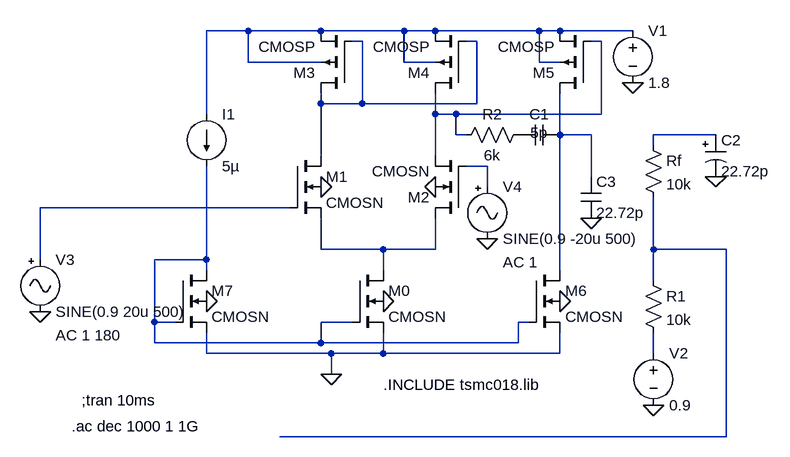
[diagram p0: schematic 2stage_OTA_230102044.asc]
2stage_OTA_230102044.asc, the LTspice schematic file:
Version 4
SHEET 1 988 680
WIRE -16 32 -80 32
WIRE 96 32 -16 32
WIRE 224 32 96 32
WIRE 272 32 224 32
WIRE 432 32 272 32
WIRE 464 32 432 32
WIRE 576 32 464 32
WIRE 160 48 144 48
WIRE 336 48 320 48
WIRE 528 48 512 48
WIRE -16 80 -16 32
WIRE 96 80 -16 80
WIRE 224 80 224 32
WIRE 272 80 224 80
WIRE 432 80 432 32
WIRE 464 80 432 80
WIRE 96 144 96 128
WIRE 160 144 160 48
WIRE 160 144 96 144
WIRE 336 144 336 48
WIRE 336 144 160 144
WIRE -80 160 -80 32
WIRE 272 160 272 128
WIRE 304 160 272 160
WIRE 528 160 528 48
WIRE 528 160 304 160
WIRE 304 192 304 160
WIRE 320 192 304 192
WIRE 464 192 464 128
WIRE 512 192 464 192
WIRE 704 192 608 192
WIRE 608 208 608 192
WIRE 96 224 96 144
WIRE 272 224 272 160
WIRE 352 240 320 240
WIRE 512 256 512 192
WIRE 352 272 352 240
WIRE 48 304 -336 304
WIRE 96 368 96 320
WIRE 192 368 96 368
WIRE 272 368 272 320
WIRE 272 368 192 368
WIRE 608 368 608 288
WIRE 720 368 608 368
WIRE -336 384 -336 304
WIRE -80 384 -80 240
WIRE -80 384 -160 384
WIRE -80 400 -80 384
WIRE 192 400 192 368
WIRE 464 400 464 192
WIRE 608 416 608 368
WIRE -160 480 -160 384
WIRE -128 480 -160 480
WIRE 144 480 96 480
WIRE 416 480 400 480
WIRE -160 512 -160 480
WIRE 96 512 96 480
WIRE 96 512 -160 512
WIRE 400 512 400 480
WIRE 400 512 96 512
WIRE -80 528 -80 496
WIRE 112 528 -80 528
WIRE 192 528 192 496
WIRE 192 528 112 528
WIRE 464 528 464 496
WIRE 464 528 192 528
WIRE 608 528 608 496
WIRE 112 560 112 528
WIRE 720 656 720 368
WIRE 720 656 32 656
FLAG 576 112 0
FLAG 272 272 0
FLAG 96 272 0
FLAG 192 448 0
FLAG -80 448 0
FLAG 608 608 0
FLAG 352 352 0
FLAG 112 560 0
FLAG 704 256 0
FLAG 512 320 0
FLAG -336 464 0
FLAG 464 448 0
SYMBOL current -80 160 R0
WINDOW 123 0 0 Left 2
WINDOW 39 0 0 Left 2
SYMATTR InstName I1
SYMATTR Value 5µ
SYMBOL cmosp 144 128 R180
SYMATTR InstName M3
SYMATTR Value2 l=0.9um w=17.55um
SYMBOL cmosp 320 128 R180
SYMATTR InstName M4
SYMATTR Value2 l=0.9um w=17.55um
SYMBOL cmosn -128 400 R0
SYMATTR InstName M7
SYMATTR Value2 l=0.9um w=0.98um
SYMBOL cmosn 144 400 R0
SYMATTR InstName M0
SYMATTR Value2 l=0.9um w=9.78um
SYMBOL cmosn 48 224 R0
SYMATTR InstName M1
SYMATTR Value2 l=0.9um w=0.22mm
SYMBOL cmosn 320 320 R180
SYMATTR InstName M2
SYMATTR Value2 l=0.9um w=0.22mm
SYMBOL res 592 192 R0
SYMATTR InstName Rf
SYMATTR Value 10k
SYMBOL res 592 400 R0
SYMATTR InstName R1
SYMATTR Value 10k
SYMBOL voltage 608 512 R0
WINDOW 123 0 0 Left 2
WINDOW 39 0 0 Left 2
SYMATTR InstName V2
SYMATTR Value 0.9
SYMBOL Misc\\signal 352 256 R0
WINDOW 123 24 132 Left 2
WINDOW 39 0 0 Left 2
SYMATTR Value2 AC 1
SYMATTR InstName V4
SYMATTR Value SINE(0.9 -20u 500)
SYMBOL cmosp 512 128 R180
SYMATTR InstName M5
SYMATTR Value2 l=0.18um w=14.06um
SYMBOL polcap 688 192 R0
WINDOW 3 24 56 Left 2
SYMATTR Value 22.72p
SYMATTR InstName C2
SYMATTR Description Capacitor
SYMATTR Type cap
SYMATTR SpiceLine V=6.3 Irms=0 Rser=4 Lser=0
SYMBOL cap 464 176 R90
WINDOW 0 0 32 VBottom 2
WINDOW 3 28 32 VBottom 2
SYMATTR InstName C1
SYMATTR Value 5p
SYMBOL res 416 176 R90
WINDOW 0 0 56 VBottom 2
WINDOW 3 32 56 VTop 2
SYMATTR InstName R2
SYMATTR Value 6k
SYMBOL cap 496 256 R0
SYMATTR InstName C3
SYMATTR Value 22.72p
SYMBOL voltage 576 16 R0
WINDOW 123 0 0 Left 2
WINDOW 39 0 0 Left 2
SYMATTR InstName V1
SYMATTR Value 1.8
SYMBOL Misc\\signal -336 368 R0
WINDOW 123 24 132 Left 2
WINDOW 39 0 0 Left 2
SYMATTR InstName V3
SYMATTR Value SINE(0.9 20u 500)
SYMATTR Value2 AC 1 180
SYMBOL cmosn 416 400 R0
SYMATTR InstName M6
SYMATTR Value2 l=0.18um w=3.19um
TEXT 192 576 Left 2 !.INCLUDE tsmc018.lib
TEXT -272 600 Left 2 !;tran 10ms
TEXT -288 640 Left 2 !.ac dec 1000 1 1G

The netlist it stands for:
* 2stage_OTA_230102044.asc
I1 N001 N010 5µ
M3 N002 N002 N001 N001 CMOSP l=0.9um w=17.55um
M4 N003 N002 N001 N001 CMOSP l=0.9um w=17.55um
M7 N010 N010 0 0 CMOSN l=0.9um w=0.98um
M0 N008 N010 0 0 CMOSN l=0.9um w=9.78um
M1 N002 N007 N008 0 CMOSN l=0.9um w=0.22mm
M2 N008 N006 N003 0 CMOSN l=0.9um w=0.22mm
Rf N005 N009 10k
R1 N009 N011 10k
V2 N011 0 0.9
V4 N006 0 SINE(0.9 -20u 500) AC 1
M5 N004 N003 N001 N001 CMOSP l=0.18um w=14.06um
C2 N005 0 22.72p V=6.3 Irms=0 Rser=4 Lser=0
C1 N004 P001 5p
R2 P001 N003 6k
C3 N004 0 22.72p
V1 N001 0 1.8
V3 N007 0 SINE(0.9 20u 500) AC 1 180
M6 N004 N010 0 0 CMOSN l=0.18um w=3.19um
.model NMOS NMOS
.model PMOS PMOS
.lib standard.mos
.INCLUDE tsmc018.lib
;tran 10ms
.ac dec 1000 1 1G
.backanno
.end